# EAGLE design optMotorButtonBoard (EAGLE 9.5.1)
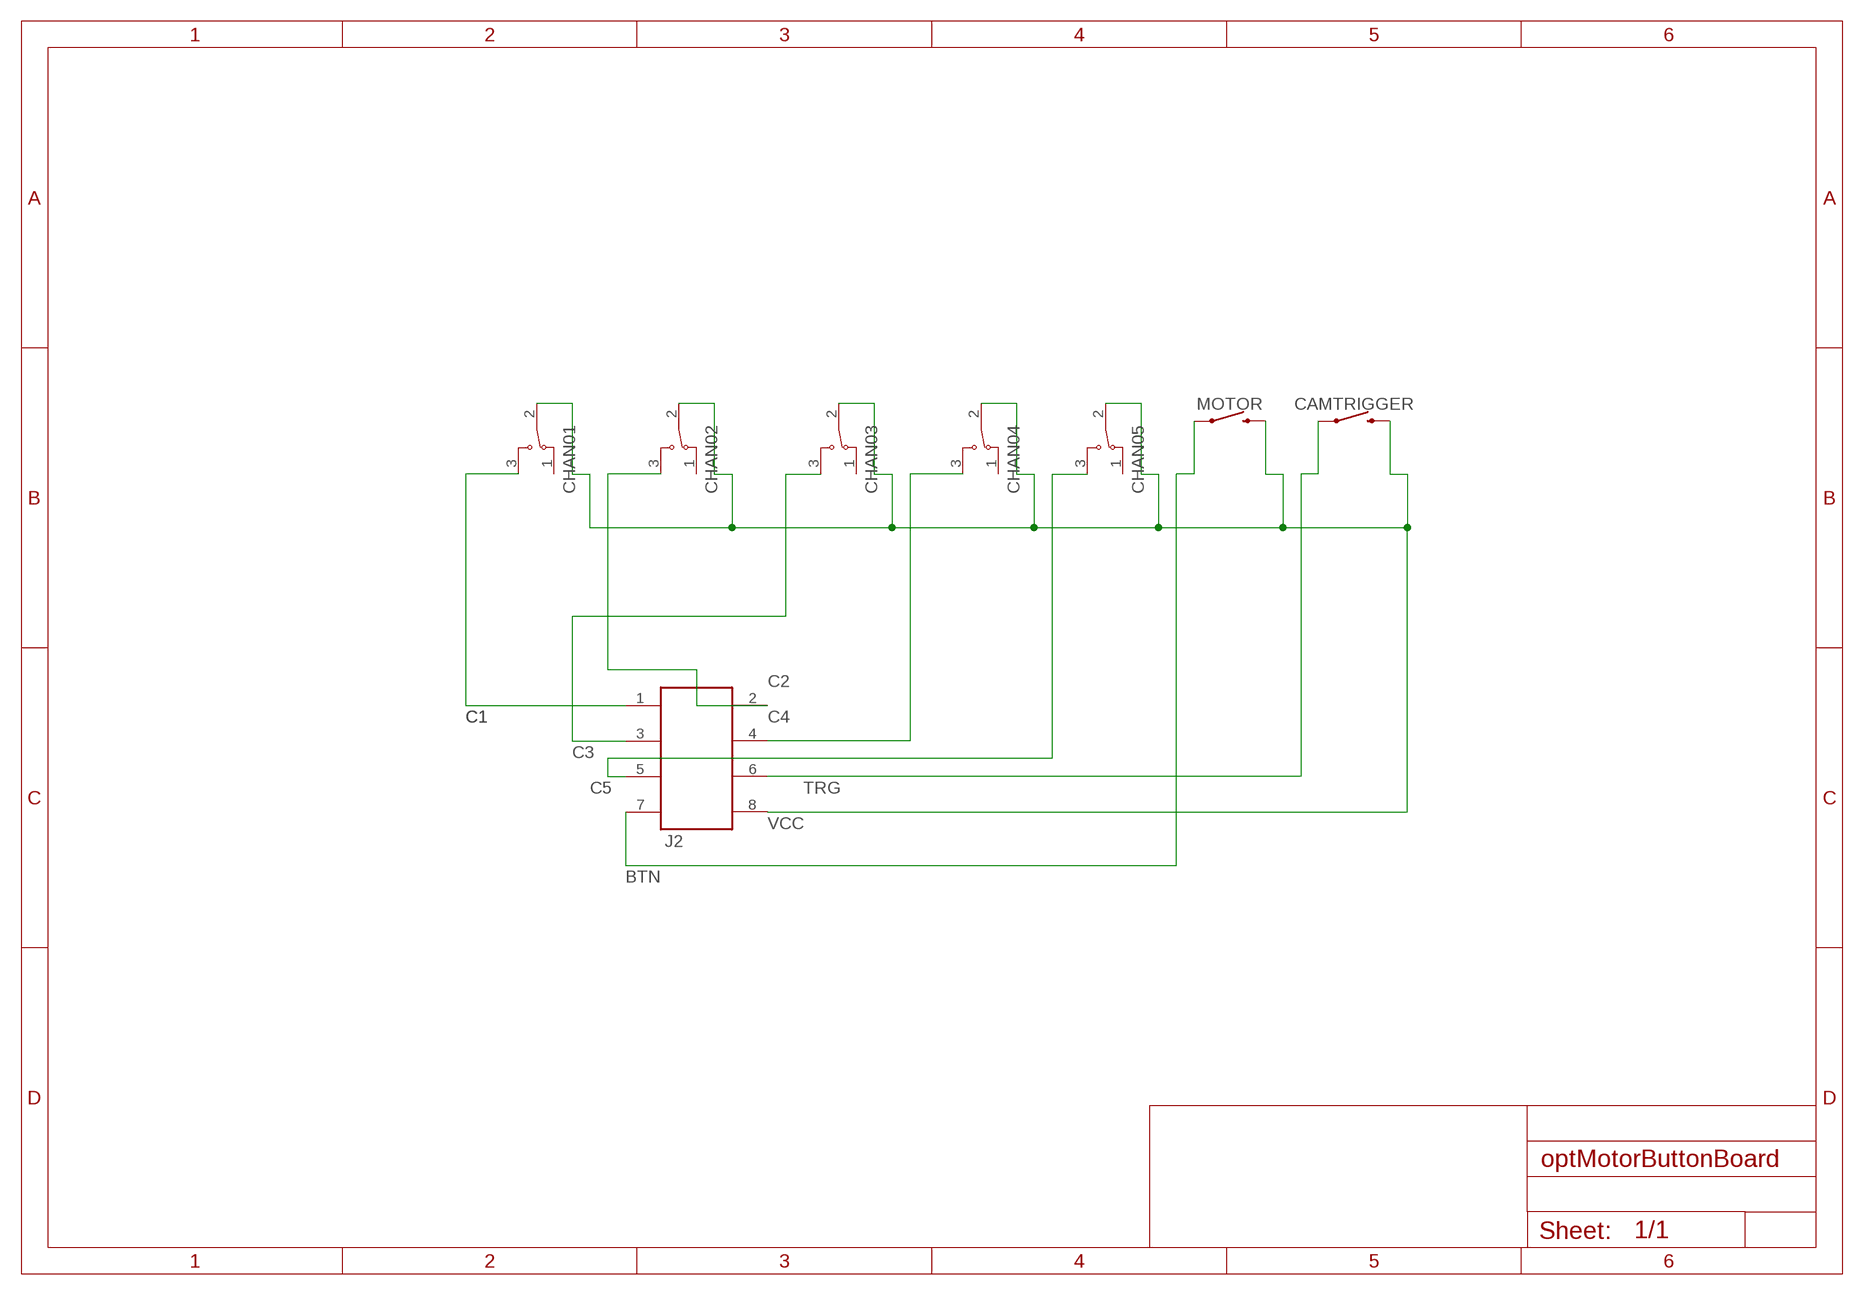
[diagram p0: schematic, sheet 1]

## Parts
CAMTRIGGER  MOMENTARY-SWITCH-SPST-PTH-12MM  [TACTILE_SWITCH_PTH_12MM]
CHAN01  ATE1E-2M3-10-Z  [ATE1E-2M3-10-Z]
CHAN02  ATE1E-2M3-10-Z  [ATE1E-2M3-10-Z]
CHAN03  ATE1E-2M3-10-Z  [ATE1E-2M3-10-Z]
CHAN04  ATE1E-2M3-10-Z  [ATE1E-2M3-10-Z]
CHAN05  ATE1E-2M3-10-Z  [ATE1E-2M3-10-Z]
J2  62400821722  [62400821722]
MOTOR  MOMENTARY-SWITCH-SPST-PTH-12MM  [TACTILE_SWITCH_PTH_12MM]

## Nets
BTN: J2.7 MOTOR.1
C1: CHAN01.3 J2.1
C2: CHAN02.3 J2.2
C3: CHAN03.3 J2.3
C4: CHAN04.3 J2.4
C5: CHAN05.3 J2.5
TRG: CAMTRIGGER.1 J2.6
VCC: CAMTRIGGER.3 CHAN01.2 CHAN02.2 CHAN03.2 CHAN04.2 CHAN05.2 J2.8 MOTOR.3
Unconnected: CHAN01.1 CHAN02.1 CHAN03.1 CHAN04.1 CHAN05.1

## Library data of the parts
CAMTRIGGER MOTOR = SparkFun-Switches:MOMENTARY-SWITCH-SPST: Momentary Switch (Pushbutton) - SPST Normally-open (NO) SPST momentary switches (buttons, pushbuttons). Variants PTH-12MM - 12mm square, through-hole Momentary Pushbutton Switch - 12mm Square <https://www.sparkfun.com/products/9190> (COM-09190) PTH-6.0MM, PTH-6.0MM-KIT - 6.0mm square, through-hole Mini Pushbutton Switch <https://www.sparkfun.com/products/97> (COM-00097) KIT package intended for soldering kit's - only one side of pads' copper is exposed. PTH-RIGHT-ANGLE-KIT - Right-angle, through-hole Right Angle Tactile Button <https://www.sparkfun.com/products/10791> - Used on SparkFun BigTime Watch Kit <https://www.sparkfun.com/products/11734> SMD-12MM - 12mm square, surface-mount Tactile Button - SMD (12mm) <https://www.sparkfun.com/products/12993> (COM-12993) Used on SparkFun PicoBoard <https://www.sparkfun.com/products/11888> SMD-4.5MM - 4.5mm Square Trackball Switch Used on SparkFun Blackberry Trackballer Breakout <https://www.sparkfun.com/products/13169> SMD-4.6MMX2.8MM - 4.60mm x 2.80mm, surface mount Used on SparkFun SAMD21 Mini Breakout <https://www.sparkfun.com/products/13664> SMD-5.2MM, SMD-5.2-REDUNDANT - 5.2mm square, surface-mount Mini Pushbutton Switch - SMD <https://www.sparkfun.com/products/8720> (COM-08720) Used on Arduino Pro Mini <https://www.sparkfun.com/products/11114> REDUNDANT package connects both switch circuits together SMD-6.0X3.5MM - 6.0 x 3.5mm, surface mount Momentary Reset Switch SMD <https://www.sparkfun.com/products/8229> (COM-08229) SMD-6.2MM-TALL - 6.2mm square, surface mount Tactile Button - SMD (6mm) <https://www.sparkfun.com/products/12992> Used on SparkFun Digital Sandbox <https://www.sparkfun.com/products/12651> SMD-RIGHT-ANGLE - Right-angle, surface mount Used on SparkFun Block for Intel® Edison - Arduino <https://www.sparkfun.com/products/13036>; PROD_ID: SWCH-09185; SF_SKU: COM-09190
CHAN01-CHAN05 = Switch:ATE1E-2M3-10-Z: SWITCH TOGGLE SPDT 50MA 48V Manufacturer's datasheet <https://www.nidec-copal-electronics.com/e/catalog/switch/ate.pdf>; CREATED_BY: PCBLayout.com; DIGIKEY_PARTNO: 563-1159-ND; MANUFACTURER: Nidec Copal Electronics; MPN: ATE1E-2M3-10-Z
J2 = Wurth_Elektronik_Electromechanic_Wire_to_Board_Connectors_rev19a:62400821722: WR-WTB Wire-to-Board Connevtors 2.00mm-Dual Row Male Horizontal Shrouded Header, 8 Pins=>Code : WR-WTB_Stiftleiste_62400821722 <http://katalog.we-online.de/media/thumbs2/eican/thb_WR-WTB_Stiftleiste_6240xx21722.jpg> Details see: http://katalog.we-online.de/en/em/WTB_2_00_MALE_DUAL_ROW_HORIZONTAL_SHROUDED_HEADER_W_POSITIVE_LOCKING_6240XX21722 Created 2014-06-05, Karrer Zheng 2014 (C) Würth Elektronik

## Board
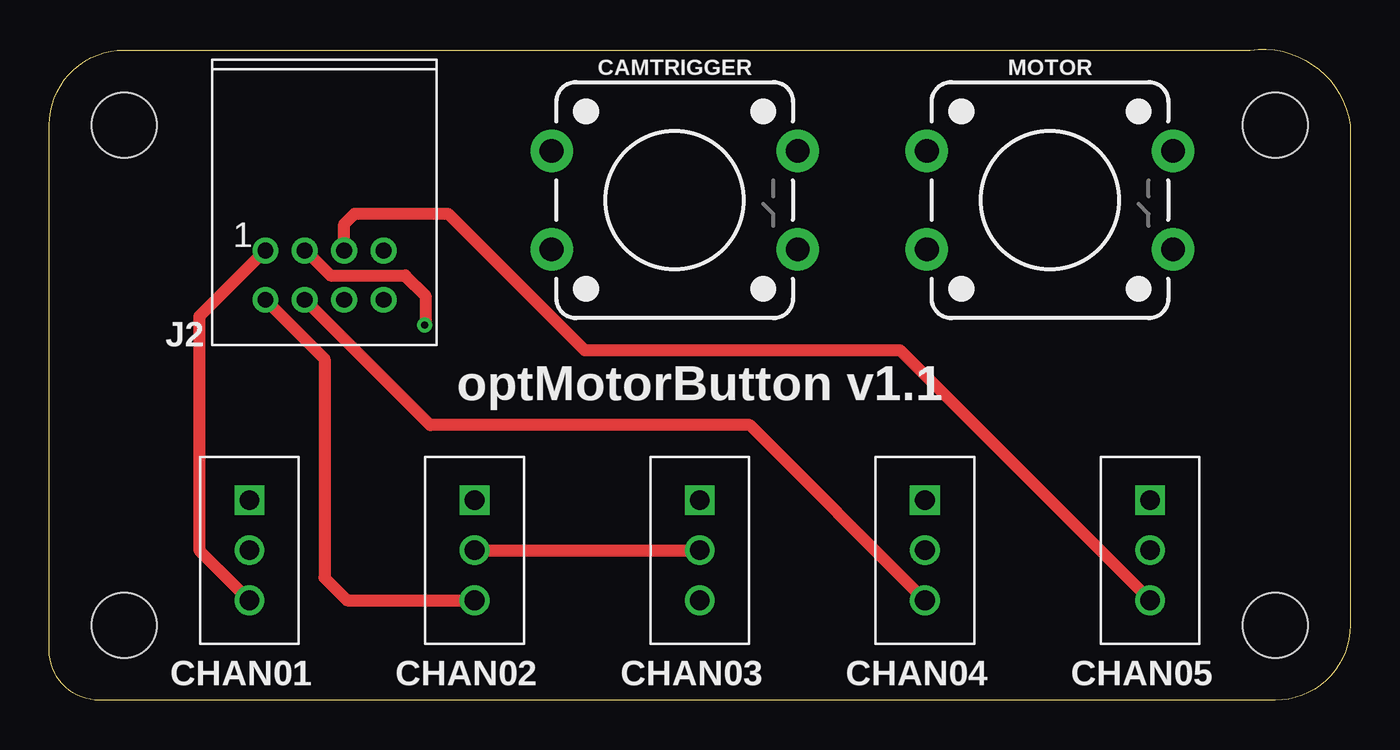
[diagram p1: board, top side]
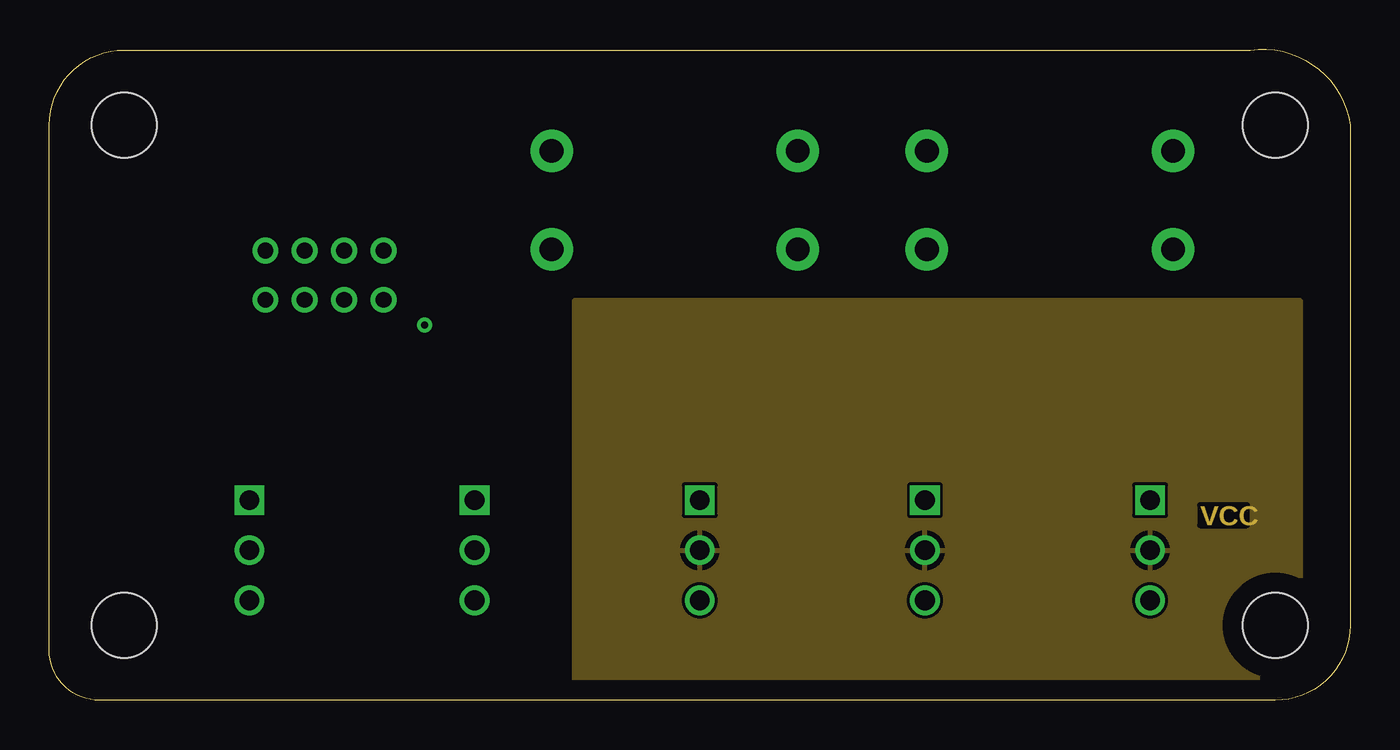
[diagram p2: board, inner layer Route2]
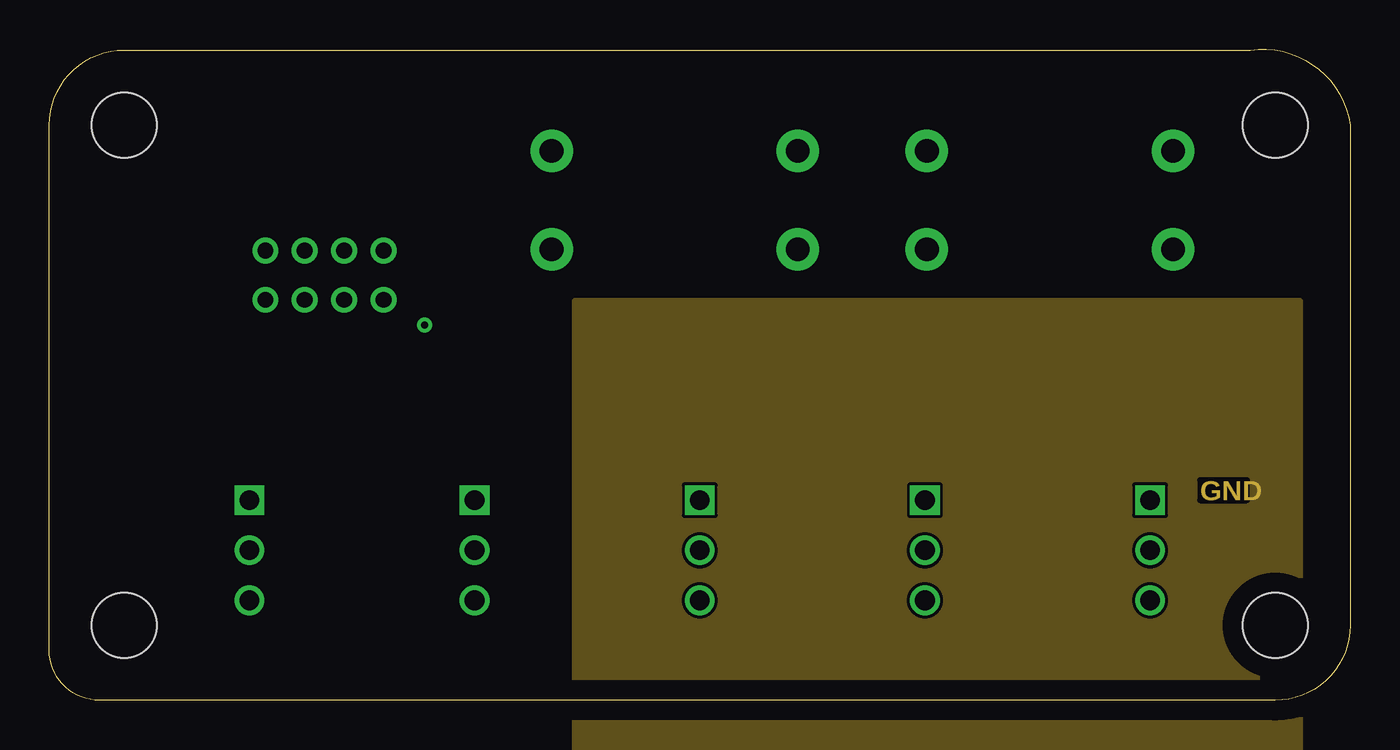
[diagram p3: board, inner layer Route15]
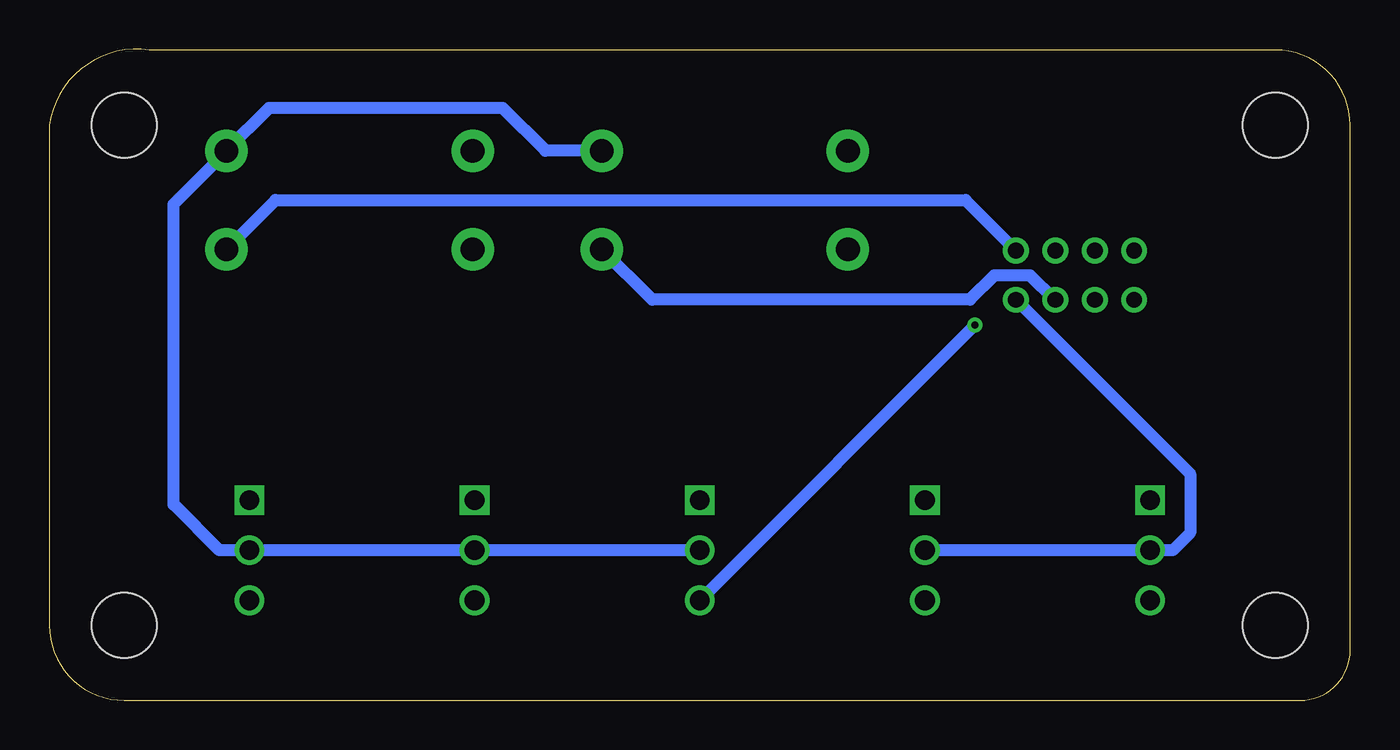
[diagram p4: board, bottom side, seen from below]

Size 66.04 x 33.06 mm. Coordinates in mm from the lower left corner, seen from the top.
Outline: 3.81,33.02 60.96,33.02 arc-90 66.04,29.21 66.04,3.81 arc-90 62.23,0 2.54,0 arc-90 0,2.54 0,29.21 arc-90 3.81,33.02
Copper layers (1*16): Top 0.035mm / dielectric 1.5mm / Bottom 0.035mm
Design rules "default": minimum track width 6mil, minimum drill 0.35mm, track to track 6mil, track to pad 6mil, pad to pad 6mil, via to via 6mil, smd to smd 6mil, copper to edge 40mil, drill to drill 6mil, minimum pad ring 10mil, minimum via ring 8mil, stop-mask expansion 4mil, vias tented up to drill 0mil, thermal gap 10mil

### Footprints (pad centres in the part's own frame; a part is rotated, then mirrored left to right if it is on the bottom)
TACTILE_SWITCH_PTH_12MM = drill 1.2 pad 2.159: 1 6.25,-2.5; 2 -6.25,-2.5; 3 6.25,2.5; 4 -6.25,2.5
ATE1E-2M3-10-Z = drill 1 square: 1 0,-2.54 | drill 1: 2 0,0; 3 0,2.54
62400821722 = drill 0.8: 1 3,-1.25; 2 3,1.25; 3 1,-1.25; 4 1,1.25; 5 -1,-1.25; 6 -1,1.25; 7 -3,-1.25; 8 -3,1.25
STAND-OFF = hole 3.302: 0,0

### Placement (x,y rotation side)
CAMTRIGGER  31.75,25.4 0 top
CHAN01  10.16,7.62 180 top
CHAN02  21.59,7.62 180 top
CHAN03  33.02,7.62 180 top
CHAN04  44.45,7.62 180 top
CHAN05  55.88,7.62 180 top
J2  13.97,21.59 180 top
MOTOR  50.8,25.4 0 top
U$1  [STAND-OFF]  3.81,29.21 0 top
U$2  [STAND-OFF]  3.81,3.81 0 top
U$3  [STAND-OFF]  62.23,29.21 0 top
U$4  [STAND-OFF]  62.23,3.81 0 top

### Tracks (layer width: path | path; a pad name or v marks a point on that pad's centre or on a via)
BTN
  Bottom 0.61: MOTOR.1 54.55,25.4 19.53,25.4 J2.7
C1
  Top 0.61: J2.1 7.62,19.49 7.62,7.62 CHAN01.3
C2
  Top 0.61: J2.2 13.97,17.34 13.97,6.22 15.11,5.08 CHAN02.3
C3  (via drill 0.35)
  Top 0.61: v19.05,19.05 19.1,19.1 19.1,20.55 18.06,21.58 14.28,21.58 13.02,22.84 J2.3
  Bottom 0.61: v19.05,19.05 CHAN03.3
C4
  Top 0.61: J2.4 19.34,13.97 35.56,13.97 CHAN04.3
C5
  Top 0.61: J2.5 14.97,24.19 15.49,24.71 20.24,24.71 27.18,17.78 43.18,17.78 CHAN05.3
GND
  pour Route15: 26.67,20.32 63.5,20.32 63.5,-10.16 26.67,-10.16
  pour Route15: -105.41,21.59 -68.58,21.59 -68.58,-8.89 -105.41,-8.89
TRG
  Bottom 0.61: J2.6 15.02,20.34 16.26,21.58 18.06,21.58 19.3,20.34 35.44,20.34 CAMTRIGGER.1
VCC
  Top 0.61: CHAN02.2 CHAN03.2
  Bottom 0.61: CAMTRIGGER.3 40.85,27.9 43.02,30.07 54.88,30.07 MOTOR.3 57.05,27.87 59.73,25.19 59.73,9.95 57.4,7.62 CHAN05.2 CHAN04.2 CHAN03.2 | CHAN02.2 CHAN01.2 9.02,7.62 8.13,8.51 8.13,11.5 J2.8
  pour Route2: 26.67,20.32 63.5,20.32 63.5,-10.16 26.67,-10.16
  pour Route2: -105.41,21.59 -68.58,21.59 -68.58,-8.89 -105.41,-8.89

### Text on the board
Route2: VCC | VCC
Route15: GND | GND
tPlace: optMotorButton v1.1